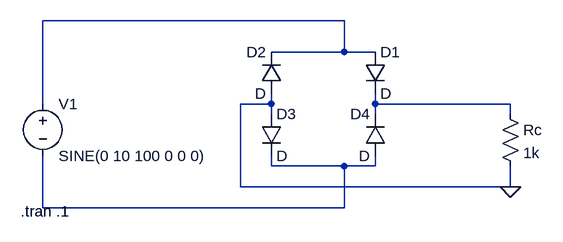
[diagram p0: schematic puenteDeDiodos.asc]
puenteDeDiodos.asc, the LTspice schematic file:
Version 4
SHEET 1 880 680
WIRE 352 48 -112 48
WIRE 352 96 352 48
WIRE 352 96 240 96
WIRE 400 96 352 96
WIRE -112 176 -112 48
WIRE 240 176 240 160
WIRE 240 176 192 176
WIRE 400 176 400 160
WIRE 608 176 400 176
WIRE 240 192 240 176
WIRE 400 192 400 176
WIRE 608 192 608 176
WIRE 240 272 240 256
WIRE 352 272 240 272
WIRE 400 272 400 256
WIRE 400 272 352 272
WIRE 192 304 192 176
WIRE 608 304 608 272
WIRE 608 304 192 304
WIRE -112 336 -112 256
WIRE 352 336 352 272
WIRE 352 336 -112 336
FLAG 608 304 0
SYMBOL voltage -112 160 R0
WINDOW 123 0 0 Left 0
WINDOW 39 0 0 Left 0
SYMATTR InstName V1
SYMATTR Value SINE(0 10 100 0 0 0)
SYMBOL diode 384 96 R0
SYMATTR InstName D1
SYMBOL diode 256 160 R180
WINDOW 0 24 64 Left 2
WINDOW 3 24 0 Left 2
SYMATTR InstName D2
SYMBOL diode 224 192 R0
SYMATTR InstName D3
SYMBOL diode 416 256 R180
WINDOW 0 24 64 Left 2
WINDOW 3 24 0 Left 2
SYMATTR InstName D4
SYMBOL res 592 176 R0
SYMATTR InstName Rc
SYMATTR Value 1k
TEXT -146 342 Left 2 !.tran .1

The netlist it stands for:
* puenteDeDiodos.asc
V1 N001 N003 SINE(0 10 100 0 0 0)
D1 N001 N002 D
D2 0 N001 D
D3 0 N003 D
D4 N003 N002 D
Rc N002 0 1k
.model D D
.lib standard.dio
.tran .1
.backanno
.end